# EAGLE design EC11 breakout (EAGLE 7.7.0)
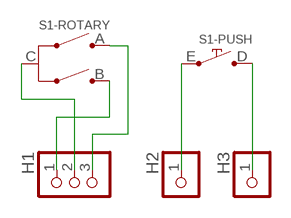
[diagram p0: schematic, sheet 1]

## Parts
H1  PINHD-1X03ROUND  [1X03-ROUND]
H2  PINHD-1X01ROUND  [1X01-ROUND]
H3  PINHD-1X01ROUND  [1X01-ROUND]
S1  EC11  [EC11]

## Nets
N$1: H1.2 S1.C(-ROTARY:C)
N$2: H2.1 S1.E(-PUSH:E)
N$3: H1.3 S1.A(-ROTARY:A)
N$4: H1.1 S1.B(-ROTARY:B)
N$5: H3.1 S1.D(-PUSH:D)

## Library data of the parts
H1 = Tonn:PINHD-1X03: Pin header 1x3, 100 mil
H2 H3 = Tonn:PINHD-1X01: Pin header 1x1, 100 mil
S1 = Tonn:EC11

## Board
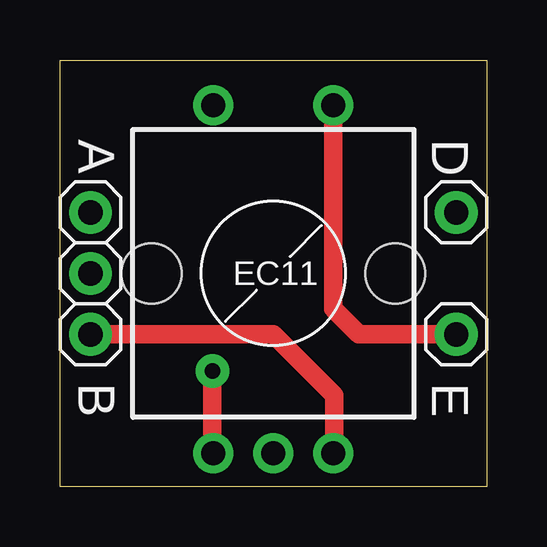
[diagram p1: board, top side]
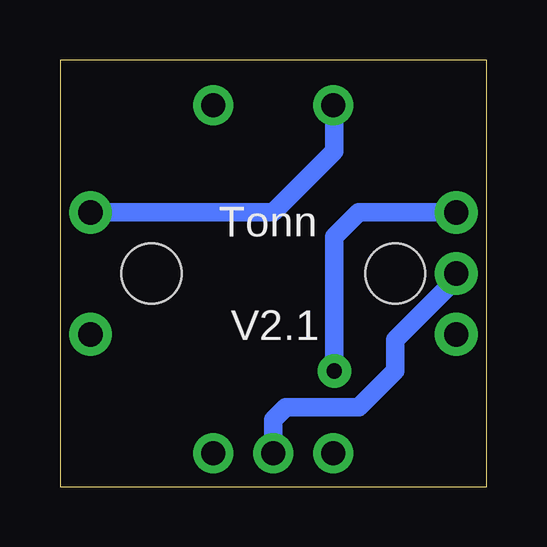
[diagram p2: board, bottom side, seen from below]

Size 17.78 x 17.78 mm. Coordinates in mm from the lower left corner, seen from the top.
Outline: 0,0 0,17.78 17.78,17.78 17.78,0 0,0
Copper layers (1*16): Top 0.035mm / dielectric 1.5mm / Bottom 0.035mm
Design rules "oshpark": minimum track width 6mil, minimum drill 13mil, track to track 6mil, track to pad 6mil, pad to pad 6mil, via to via 6mil, smd to smd 6mil, copper to edge 5mil, drill to drill 8mil, minimum pad ring 7mil, minimum via ring 7mil, stop-mask expansion 4mil, vias tented up to drill 25mil, thermal gap 10mil

### Footprints (pad centres in the part's own frame; a part is rotated, then mirrored left to right if it is on the bottom)
1X03-ROUND = drill 1.016 pad 1.778: 1 0,0; 2 2.54,0; 3 5.08,0
1X01-ROUND = drill 1.016 pad 1.778: 1 0,0
EC11 = drill 1 pad 1.676: A -2.5,-7.5; B 2.5,-7.5; C 0,-7.5; D -2.5,7; E 2.5,7 | hole 2.5: -5.08,0; 5.08,0

### Placement (x,y rotation side)
H1  1.27,6.35 90 top
H2  16.51,6.35 0 top
H3  16.51,11.43 0 top
S1  8.89,8.89 0 top

### Tracks (layer width: path | path; a pad name or v marks a point on that pad's centre or on a via)
N$1
  Bottom 0.762: S1.C 8.89,2.79 8.38,3.3 5.33,3.3 3.81,4.83 3.81,6.13 1.27,8.67 H1.2
N$2
  Top 0.762: S1.E 11.39,7.41 12.45,6.35 H2.1
N$3  (via drill 0.64 pad 1.4)
  Top 0.762: v6.35,4.83 6.35,1.43 S1.A
  Bottom 0.762: H1.3 5.33,11.43 6.35,10.41 v6.35,4.83
N$4
  Top 0.762: H1.1 8.89,6.35 11.43,3.81 11.43,1.43 S1.B
N$5
  Bottom 0.762: S1.D 6.35,15.85 6.35,13.97 8.89,11.43 H3.1

### Text on the board
tPlace: A | D | B | E
bPlace: Tonn | V2.1